# Altium schematic sheet Gate Driver 3.SchDoc
size A3
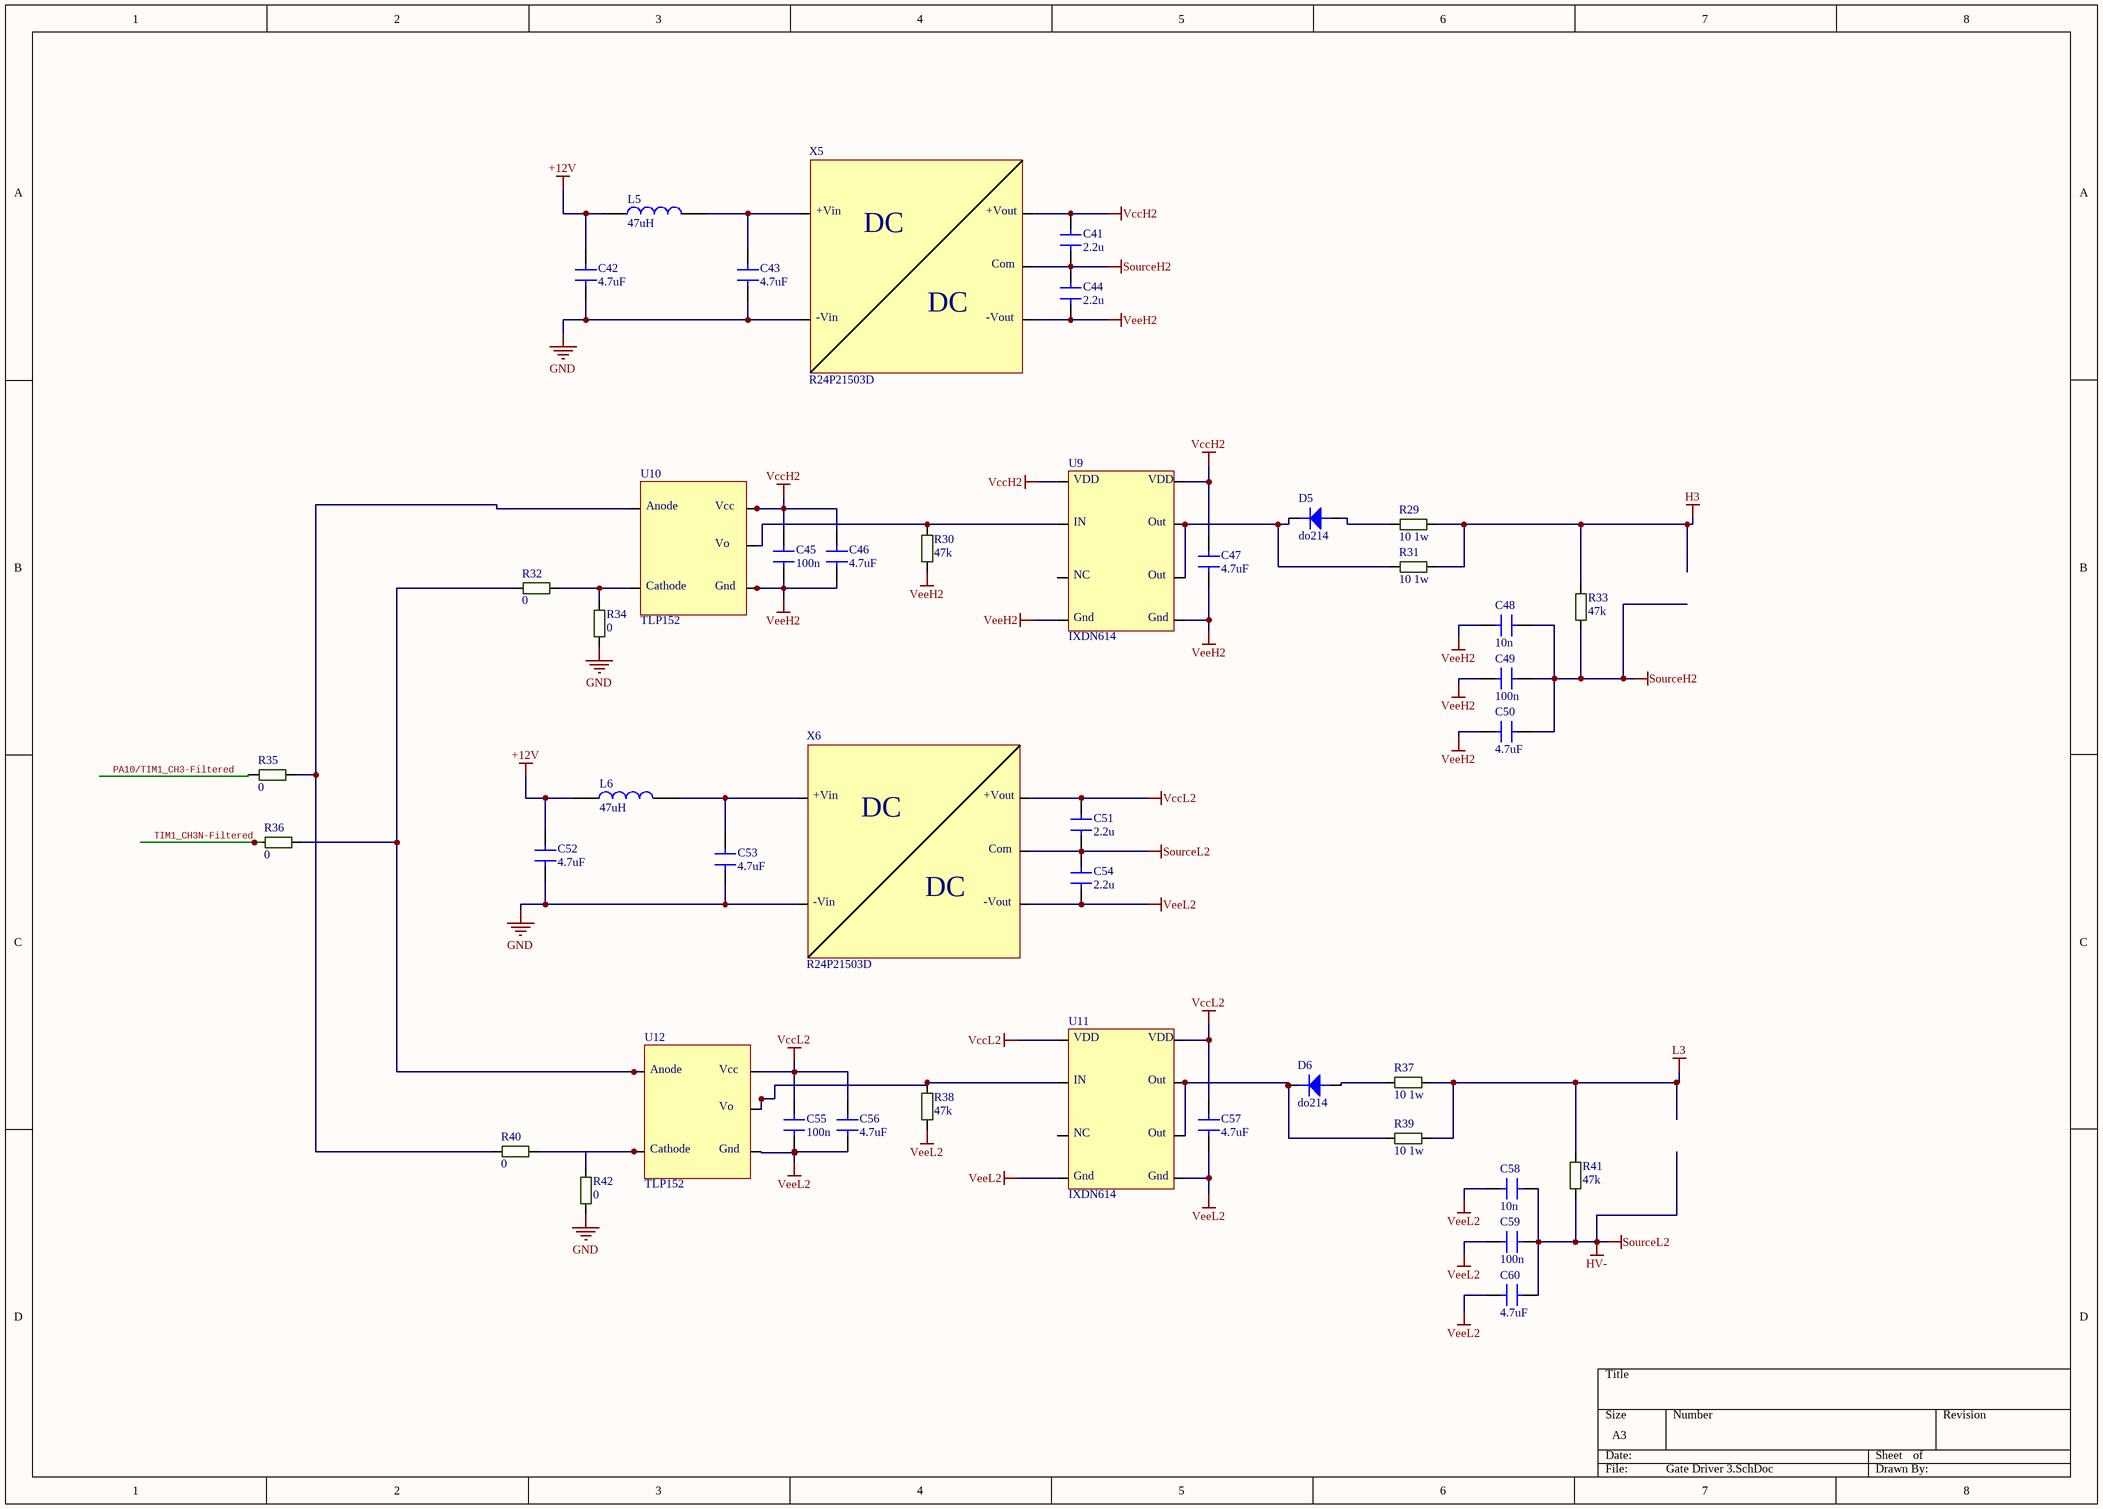
[diagram p0: Gate Driver 3.SchDoc]

## Parts
C41  2.2u  [C-0805]
C42  4.7uF  [C-1206]
C43  4.7uF  [C-1206]
C44  2.2u  [C-0805]
C45  100n  [C-0805]
C46  4.7uF  [C-1206]
C47  4.7uF  [C-1206]
C48  10n  [C-0805]
C49  100n  [C-0805]
C50  4.7uF  [C-1206]
C51  2.2u  [C-0805]
C52  4.7uF  [C-1206]
C53  4.7uF  [C-1206]
C54  2.2u  [C-0805]
C55  100n  [C-0805]
C56  4.7uF  [C-1206]
C57  4.7uF  [C-1206]
C58  10n  [C-0805]
C59  100n  [C-0805]
C60  4.7uF  [C-1206]
D5  do214  [DO-214AC]
D6  do214  [DO-214AC]
L5  47uH  [WE-TPC_282892]
L6  47uH  [WE-TPC_282892]
R29  10 1w  [R-2512]
R30  47k  [R-0805]
R31  10 1w  [R-2512]
R32  0  [R-0805]
R33  47k  [R-0805]
R34  0  [R-0805]
R35  0  [R-0805]
R36  0  [R-0805]
R37  10 1w  [R-2512]
R38  47k  [R-0805]
R39  10 1w  [R-2512]
R40  0  [R-0805]
R41  47k  [R-0805]
R42  0  [R-0805]
U9  IXDN614  [FAN3122 Soic8]
U10  TLP152  [TLP152]
U11  IXDN614  [FAN3122 Soic8]
U12  TLP152  [TLP152]
X5  R24P21503D  [SIP7]
X6  R24P21503D  [SIP7]

## Nets
+12V: C42.2 C52.2 L5.1 L6.1
GND: C42.1 C43.1 C52.1 C53.1 R34.1 R42.1 X5.2 X6.2
H3: R29.2 R31.2 R33.2
HV-: C51.1 C54.2 C58.1 C59.1 C60.2 R41.1 X6.6  [also labelled SourceL2]
L3: R37.2 R39.2 R41.2
SourceH2: C41.1 C44.2 C48.1 C49.1 C50.2 R33.1 X5.6
VccH2: C41.2 C45.2 C46.2 C47.2 U9.1 U9.8 U10.5 X5.7
VccL2: C51.2 C55.2 C56.2 C57.2 U11.1 U11.8 U12.5 X6.7
VeeH2: C44.1 C45.1 C46.1 C47.1 C48.2 C49.2 C50.1 R30.1 U9.4 U9.5 U10.3 X5.5
VeeL2: C54.1 C55.1 C56.1 C57.1 C58.2 C59.2 C60.1 R38.1 U11.4 U11.5 U12.3 X6.5
PA10/TIM1_CH3-Filtered: R35.1
TIM1_CH3N-Filtered: R36.1
NetC43_2: C43.2 L5.2 X5.1
NetC53_2: C53.2 L6.2 X6.1
NetD5_a: D5.a R29.1
NetD5_k: D5.k R31.1 U9.6 U9.7
NetD6_a: D6.a R37.1
NetD6_k: D6.k R39.1 U11.6 U11.7
NetR30_2: R30.2 U9.2 U10.4
NetR32_1: R32.1 R36.2 U12.1
NetR32_2: R32.2 R34.2 U10.2
NetR35_2: R35.2 R40.1 U10.1
NetR38_2: R38.2 U11.2 U12.4
NetR40_2: R40.2 R42.2 U12.2

Not connected (* = marked no-connect by the designer): U9 3; U11 3

## Notes on the sheet
- (in symbol IXDN614SITR) VDD; IN; Out; NC; Gnd
- (in symbol R24P21503D) +Vin; +Vout; DC; Com; -Vin; -Vout
- (in symbol TLP152(TPL,E) Anode; Vcc; Vo; Cathode; Gnd

## Library data of the parts
C41 C44 C45 C48 C49 C51 C54 C55 C58 C59 = C-0805
C42 C43 C50 C52 C53 C60 = Cap1206: Cap1206 4.7uF; Özdisan Part Number: CL31B475KBHNNNE; Manufacturer: SAMSUNG; Link: https://www.ozdisan.com/pasif-komponentler/kondansatorler/smd-kondansatorler-mlcc/CL31B475KBHNNNE; Price: 0,10407
C46 C47 C56 C57 = C-1206: Cap1206 4.7uF
D5 D6 = do214: DIODE FAST SWITCHING Single 150mA 75V SMT SOD323
L5 L6 = inductor
R29 R31 R37 R39 = R-2512
R30 = Res0805: RES.(2012) 0805 47K Ohms 5% 1/8W-S 100PPM; Manufacturer: ROYALOHM; Özdisan Part Number: 0805S8J0473T5E; Link: https://www.ozdisan.com/pasif-komponentler/direncler/smt-smd-direncler/0805S8J0473T5E; Price: 0,00234
R32 R34-R36 R40 R42 = Res0805: Res0805 0R; Manufacturer: ROYALOHM; Özdisan Part Number: 0805S8J0000T5E; Price: 0,00234; Link: https://www.ozdisan.com/pasif-komponentler/direncler/smt-smd-direncler/0805S8J0000T5E
R33 R38 R41 = Res0805: RES.(2012) 0805 47K Ohms 5% 1/8W-S 100PPM; Özdisan Part Number: 0805S8J0473T5E; Manufacturer: ROYALOHM; Link: https://www.ozdisan.com/pasif-komponentler/direncler/smt-smd-direncler/0805S8J0473T5E; Price: 0,00234
U9 U11 = IXDN614SITR: 14A 8SOIC EXP MTL NON INVERTING; Manufacturer: Ixys Clare; Rise Time: 35ns; Propagation Delay: 70ns; Max Supply Voltage: 35V; Min Supply Voltage: 4.5V; Number of Outputs: 1; Fall Time: 25ns; ComponentLink1URL: https://datasheet.ciiva.com/6613/ixd-614-6613145.pdf?src-supplier=Digi-Key; ComponentLink1Description: https://datasheet.ciiva.com/6613/ixd-614-6613145.pdf?src-supplier=Digi-Key; Supplier 1: Mouser; Manufacturer Part Number: IXDN614SITR; RoHS: Yes; Pricing 1: 1 = 4.24000, 10 = 3.79000, 50 = 3.41000, 100 = 3.10000, 1000 = 2.12000, 10000 = 1.90000 (USD); Mount: Surface Mount; Case/Package: SOIC; Number of Pins: 8; Min Operating Temperature: -40°C; Max Operating Temperature: 125°C; Max Output Current: 14A; Packaging: Tape and Reel; Package Quantity: 2000; Number of Drivers: 1; Lead Free: Lead Free; Supplier Part Number 1: 849-IXDN614SITR
U10 U12 = TLP152(TPL,E: OPTOISO 3.75KV GATE DRIVER 6SO-5; Manufacturer: Toshiba; Number of Channels: 1; Propagation Delay: 165ns; Max Power Dissipation: 260mW; Direction: Unidirectional; Turn-On Delay Time: 190ns; Fall Time: 22ns; Forward Voltage: 1.57V; Output Current: 2.5A; Forward Current: 10mA; Rise Time: 18ns; High Level Output Current: 2A; Pulse Width Distortion (PWD): 50ns; ComponentLink1URL: https://datasheet.ciiva.com/41848/tlp152-datasheet-en-20120914-41848928.pdf?src-supplier=Digi-Key; ComponentLink1Description: https://datasheet.ciiva.com/41848/tlp152-datasheet-en-20120914-41848928.pdf?src-supplier=Digi-Key; Supplier 1: Mouser; Manufacturer Part Number: TLP152(TPL,E; RoHS: Yes; Stock 1: 22321; Pricing 1: 1 = 1.55000, 10 = 0.96800, 50 = 0.96800, 100 = 0.87200, 1000 = 0.54300, 10000 = 0.44000 (USD); Mount: Surface Mount; Case/Package: SO; Number of Pins: 5; Min Operating Temperature: -40°C; Max Operating Temperature: 100°C; Packaging: Tape and Reel; Package Quantity: 3000; Low Level Output Current: 2A; Max Output Current: 2.5A; Supplier Part Number 1: 757-TLP152TPLE
X5 X6 = R24P21503D: Manufacturer: Recom; Max Output Voltage: 15V; Supplier 1: Digi-Key; Manufacturer Part Number: R24P21503D; RoHS: No; Stock 1: 378; Pricing 1: 1 = 8.78000, 5 = 8.71200, 10 = 8.64500, 25 = 8.51200, 50 = 8.24600, 100 = 7.44800, 250 = 7.31500, 500 = 7.18200 (USD); Weight: 4.3g; Length: 19.5mm; Height: 12.5mm; Width: 9.8mm; Supplier Part Number 1: 945-3071-5-ND